# EAGLE design AT1846S (EAGLE 7.2.0)
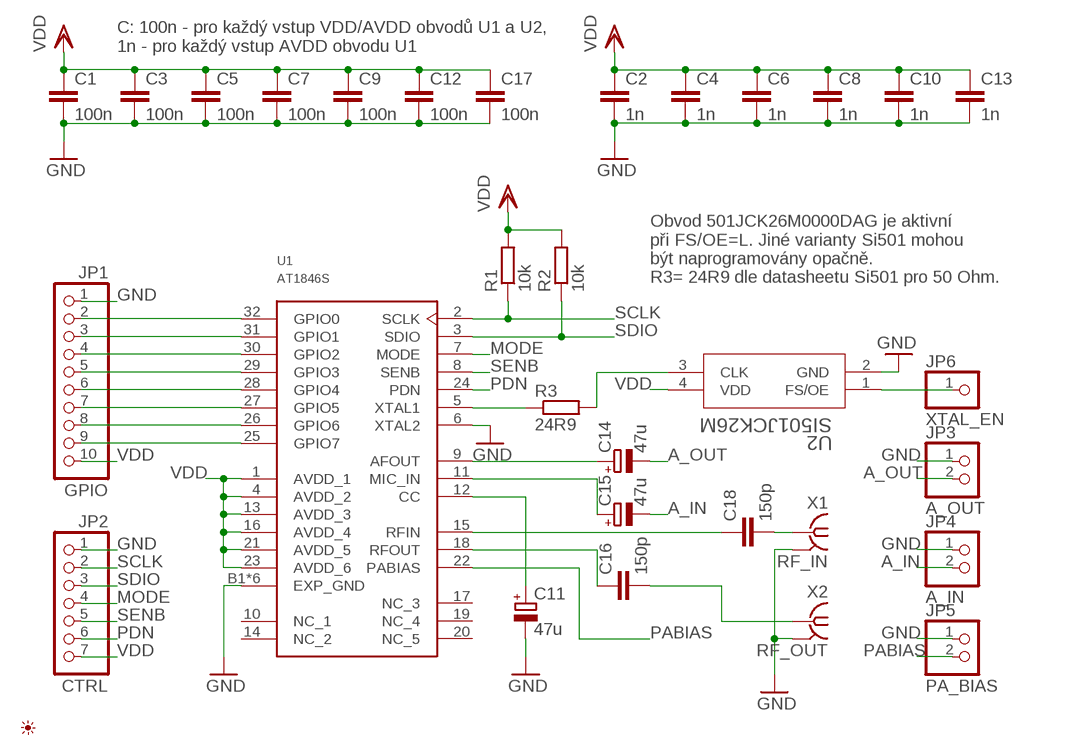
[diagram p0: schematic, sheet 1]

## Parts
C1  100n  C-EUC0603  [C0603]
C2  1n  C-EUC0603  [C0603]
C3  100n  C-EUC0603  [C0603]
C4  1n  C-EUC0603  [C0603]
C5  100n  C-EUC0603  [C0603]
C6  1n  C-EUC0603  [C0603]
C7  100n  C-EUC0603  [C0603]
C8  1n  C-EUC0603  [C0603]
C9  100n  C-EUC0603  [C0603]
C10  1n  C-EUC0603  [C0603]
C11  47u  CPOL-EUSMCA  [SMC_A]
C12  100n  C-EUC0603  [C0603]
C13  1n  C-EUC0603  [C0603]
C14  47u  CPOL-EUSMCA  [SMC_A]
C15  47u  CPOL-EUSMCA  [SMC_A]
C16  150p  C-EUC0603  [C0603]
C17  100n  C-EUC0603  [C0603]
C18  150p  C-EUC0603  [C0603]
JP1  GPIO  PINHD-1X10  [1X10]
JP2  CTRL  PINHD-1X7  [1X07]
JP3  A_OUT  PINHD-1X2  [1X02]
JP4  A_IN  PINHD-1X2  [1X02]
JP5  PA_BIAS  PINHD-1X2  [1X02]
JP6  XTAL_EN  PINHD-1X1  [1X01]
PICTO1  PICTO_1  [PICTO_1]
R1  10k  R-EU_R0603  [R0603]
R2  10k  R-EU_R0603  [R0603]
R3  24R9  R-EU_R0603  [R0603]
U1  AT1846S  [QFN32]
U2  SI501JCK26M  501  [SI501_4_2X2.5]
X1  RF_IN  SMA-142-0701-801/806  [J502-ND-142-0701-801/806]
X2  RF_OUT  SMA-142-0701-801/806  [J502-ND-142-0701-801/806]

## Nets
A_IN: C15.- JP4.2
A_OUT: C14.- JP3.2
GND: C1.2 C2.2 C3.2 C4.2 C5.2 C6.2 C7.2 C8.2 C9.2 C10.2 C11.- C12.2 C13.2 C17.2 JP1.1 JP2.1 JP3.1 JP4.1 JP5.1 U1.6(XTAL2) U1.B1(EXP_GND) U1.B2(EXP_GND) U1.B3(EXP_GND) U1.B4(EXP_GND) U1.B5(EXP_GND) U1.EXP(EXP_GND) U2.2(GND) X1.G@1 X1.G@2 X1.G@3 X1.G@4 X2.G@1 X2.G@2 X2.G@3 X2.G@4
MODE: JP2.4 U1.7(MODE)
N$1: C11.+ U1.12(CC)
N$2: C14.+ U1.9(AFOUT)
N$3: C15.+ U1.11(MIC_IN)
N$4 [RF]: C16.1 U1.18(RFOUT)
N$5 [RF]: C18.1 U1.15(RFIN)
N$6: R3.2 U2.3(CLK)
N$7: JP6.1 U2.1(FS/OE)
N$8: JP1.2 U1.32(GPIO0)
N$9: JP1.3 U1.31(GPIO1)
N$10: JP1.4 U1.30(GPIO2)
N$11: JP1.5 U1.29(GPIO3)
N$12: JP1.6 U1.28(GPIO4)
N$13: JP1.7 U1.27(GPIO5)
N$14: JP1.8 U1.26(GPIO6)
N$15: JP1.9 U1.25(GPIO7)
N$16 [RF]: C16.2 X2.1
N$17: R3.1 U1.5(XTAL1)
N$18 [RF]: C18.2 X1.1
PABIAS: JP5.2 U1.22(PABIAS)
PDN: JP2.6 U1.24(PDN)
SCLK: JP2.2 R1.1 U1.2(SCLK)
SDIO: JP2.3 R2.1 U1.3(SDIO)
SENB: JP2.5 U1.8(SENB)
VDD: C1.1 C2.1 C3.1 C4.1 C5.1 C6.1 C7.1 C8.1 C9.1 C10.1 C12.1 C13.1 C17.1 JP1.10 JP2.7 R1.2 R2.2 U1.1(AVDD_1) U1.4(AVDD_2) U1.13(AVDD_3) U1.16(AVDD_4) U1.21(AVDD_5) U1.23(AVDD_6) U2.4(VDD)
Unconnected: U1.10(NC_1) U1.14(NC_2) U1.17(NC_3) U1.19(NC_4) U1.20(NC_5)

## Notes on the sheet
- C: 100n - pro každý vstup VDD/AVDD obvodů U1 a U2,
  1n - pro každý vstup AVDD obvodu U1
- Obvod 501JCK26M0000DAG je aktivní
  při FS/OE=L. Jiné varianty Si501 mohou
  být naprogramovány opačně.
  R3= 24R9 dle datasheetu Si501 pro 50 Ohm.

## Library data of the parts
C1-C10 C12 C13 C16-C18 = rcl:C-EU: CAPACITOR, European symbol
C11 C14 C15 = rcl:CPOL-EU: POLARIZED CAPACITOR, European symbol
JP1 = pinhead:PINHD-1X10: PIN HEADER
JP2 = pinhead:PINHD-1X7: PIN HEADER
JP3-JP5 = pinhead:PINHD-1X2: PIN HEADER
JP6 = pinhead:PINHD-1X1: PIN HEADER
PICTO1 = My_Picto:PICTO_1: Zdenek Brichacek; OK3ZB; http://blog.brichacek.net
R1-R3 = rcl:R-EU_: RESISTOR, European symbol
U1 = Auctus:AT1846S: The RDA1846 is a highly integrated single-chip transceiver for Walkie Talkie applications.
U2 = Silicon Labs:501; MANUFACTURER_PART_NUMBER: 501; VENDOR: SILICONLABS
X1 X2 = con-coax:SMA-: SMA 50 Ohm End Launch Jack Receptacle - Round Contact Johnson Components Source: www.johnsoncomponents.com .. J502-ND.pdf; MF: JOHNSON COMPONENTS; MPN: 142-0701-801; OC_FARNELL: 1608592; OC_NEWARK: 90F2624

## Net classes
1 RF: clearance 0.381 mm

## Board
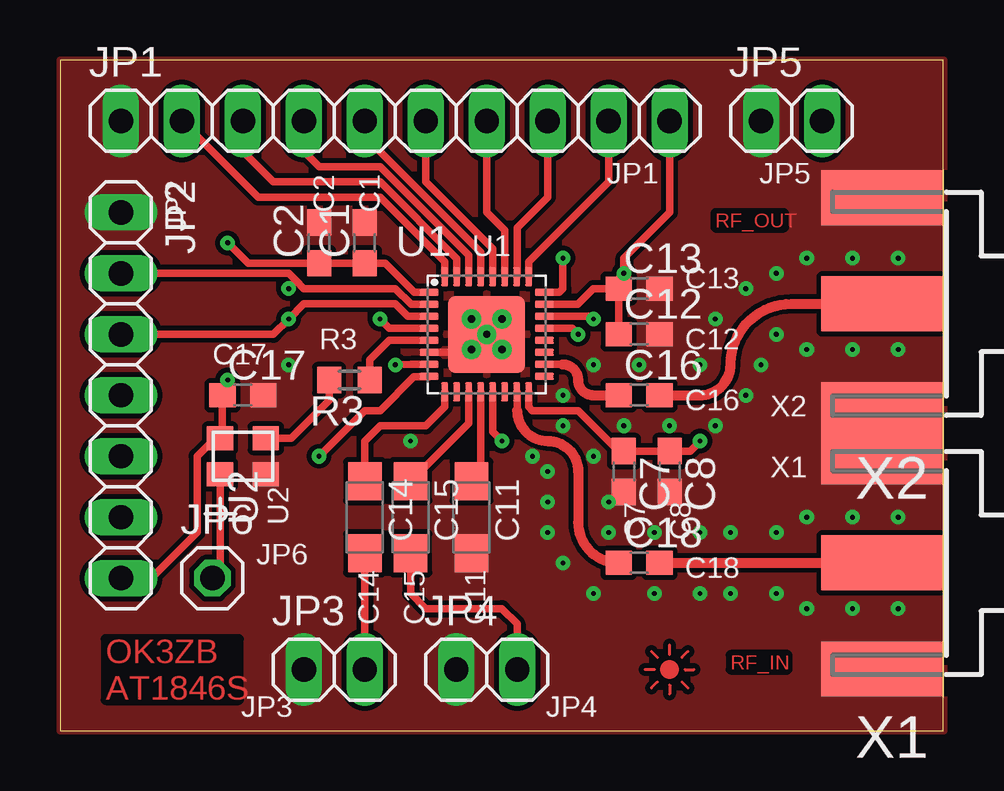
[diagram p1: board, top side]
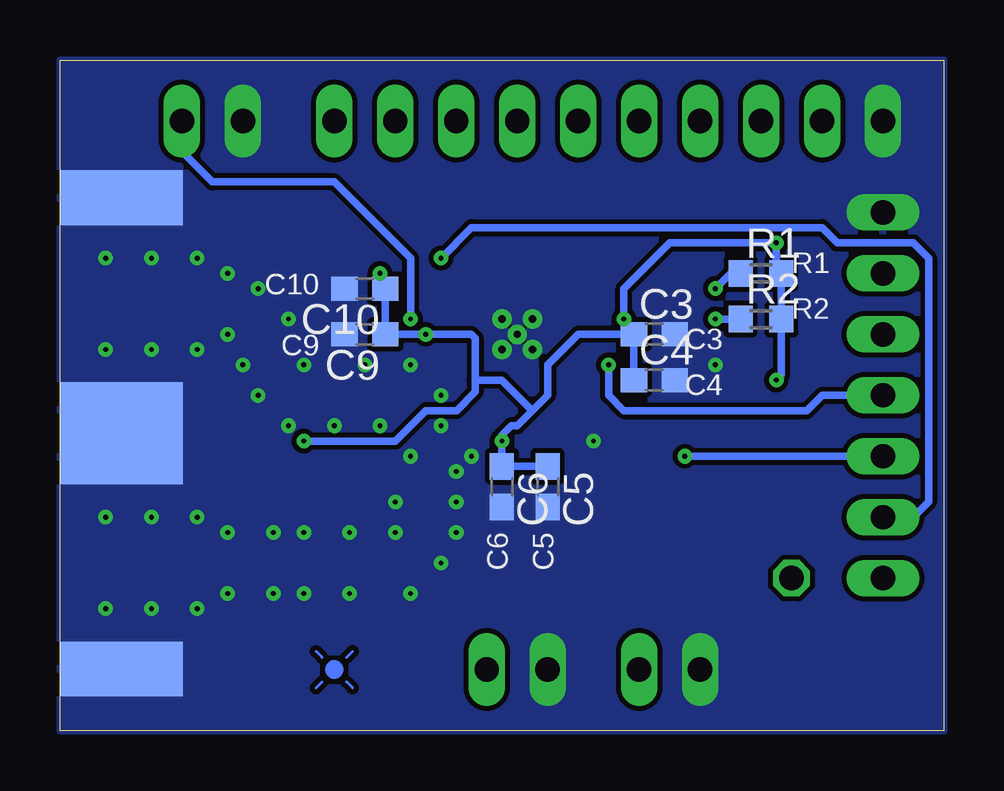
[diagram p2: board, bottom side, seen from below]

Size 36.83 x 27.94 mm. Coordinates in mm from the lower left corner, seen from the top.
Outline: 0,0 36.81,0 36.81,27.94 0,27.94 0,0
Copper layers (1*16): Top 0.035mm / dielectric 1.5mm / Bottom 0.035mm
Design rules "default *": minimum track width 10mil, minimum drill 24mil, track to track 8mil, track to pad 8mil, pad to pad 8mil, via to via 8mil, smd to smd 8mil, copper to edge 0mil, drill to drill 8mil, minimum pad ring 10mil, minimum via ring 8mil, stop-mask expansion 4mil, vias tented up to drill 0mil, thermal gap 0mil

### Footprints (pad centres in the part's own frame; a part is rotated, then mirrored left to right if it is on the bottom)
C0603 = smd 1.1 x 1: 1 -0.85,0; 2 0.85,0
SMC_A = smd 1.6 x 1.4: + -1.5,0; - 1.5,0
1X10 = drill 1.016 long: 1 -11.43,0; 2 -8.89,0; 3 -6.35,0; 4 -3.81,0; 5 -1.27,0; 6 1.27,0; 7 3.81,0; 8 6.35,0; 9 8.89,0; 10 11.43,0
1X07 = drill 1.016 long: 1 -7.62,0; 2 -5.08,0; 3 -2.54,0; 4 0,0; 5 2.54,0; 6 5.08,0; 7 7.62,0
1X02 = drill 1.016 long: 1 -1.27,0; 2 1.27,0
1X01 = drill 1.016 octagon: 1 0,0
R0603 = smd 1 x 1.1: 1 -0.85,0; 2 0.85,0
QFN32 = smd 0.8 x 0.3: 1 -2.4,1.75; 2 -2.4,1.25; 3 -2.4,0.75; 4 -2.4,0.25; 5 -2.4,-0.25; 6 -2.4,-0.75; 7 -2.4,-1.25; 8 -2.4,-1.75; 17 2.4,-1.75; 18 2.4,-1.25; 19 2.4,-0.75; 20 2.4,-0.25; 21 2.4,0.25; 22 2.4,0.75; 23 2.4,1.25; 24 2.4,1.75 | smd 0.3 x 0.8: 9 -1.75,-2.4; 10 -1.25,-2.4; 11 -0.75,-2.4; 12 -0.25,-2.4; 13 0.25,-2.4; 14 0.75,-2.4; 15 1.25,-2.4; 16 1.75,-2.4; 25 1.75,2.4; 26 1.25,2.4; 27 0.75,2.4; 28 0.25,2.4; 29 -0.25,2.4; 30 -0.75,2.4; 31 -1.25,2.4; 32 -1.75,2.4 | drill 0.3: B1 -0.635,0.635; B2 0.635,0.635; B3 -0.635,-0.635; B4 0.635,-0.635; B5 0,0 | smd 3.2 x 3.2: EXP 0,0
SI501_4_2X2.5 = smd 0.991 x 1.092: 1 -0.75,0.95; 2 -0.75,-0.95; 3 0.75,-0.95; 4 0.75,0.95
J502-ND-142-0701-801/806 = smd 5.08 x 2.286: 1 2.565,0; G@1 2.565,4.42; G@2 2.565,-4.42 | smd 5.08 x 2.286 bottom: G@3 2.565,4.42; G@4 2.565,-4.42

### Placement (x,y rotation side)
C1  12.7,20.32 90 top
C2  10.79,20.32 90 top
C3  12.06,16.51 0 bottom
C4  12.06,14.61 0 bottom
C5  16.51,10.16 270 bottom
C6  18.41,10.16 270 bottom
C7  23.5,10.79 270 top
C8  25.4,10.79 270 top
C9  24.13,16.51 180 bottom
C10  24.13,18.41 180 bottom
C11  17.14,8.89 270 top
C12  24.13,16.51 0 top
C13  24.13,18.41 0 top
C14  12.7,8.89 270 top
C15  14.61,8.89 270 top
C16  24.13,13.97 0 top
C17  7.62,13.97 0 top
C18  24.13,6.99 0 top
JP1  13.97,25.4 0 top
JP2  2.54,13.97 270 top
JP3  11.43,2.54 0 top
JP4  17.78,2.54 0 top
JP5  30.48,25.4 0 top
JP6  6.35,6.35 0 top
PICTO1  25.4,2.54 0 top
R1  7.62,19.05 0 bottom
R2  7.62,17.14 0 bottom
R3  12.06,14.61 180 top
U1  17.78,16.51 0 top
U2  7.62,11.43 90 top
X1  36.83,6.99 180 top
X2  36.83,17.78 180 top

### Tracks (layer width: path | path; a pad name or v marks a point on that pad's centre or on a via)
A_IN
  Top 0.305: C15.- 14.61,5.71 15.24,5.08 18.41,5.08 19.05,4.45 JP4.2
A_OUT
  Top 0.305: C14.- JP3.2
GND  (via drill 0.2)
  Top 0.305: U1.6 17.03,15.76 U1.B3 U1.EXP | U1.EXP U1.B4 | U1.B2 U1.EXP | U1.B1 U1.EXP
  other vias: 20.95,13.97 19.68,11.43 20.95,12.7 20.32,10.79 20.32,9.53 20.32,8.26 20.95,6.99 22.23,5.71 24.77,5.71 26.67,5.71 27.94,5.71 29.84,5.71 31.11,5.08 33.02,5.08 34.92,5.08 34.92,8.89 33.02,8.89 31.11,8.89 29.84,8.26 27.94,8.26 26.67,8.26 24.77,8.26 22.86,8.26 22.23,11.43 22.86,9.53 22.23,15.24 24.13,15.24 26.67,15.24 27.3,17.14 28.57,18.41 29.84,19.05 31.11,19.68 34.92,19.68 33.02,19.68 34.92,15.88 33.02,15.88 31.11,15.88 29.84,16.51 29.21,15.24 28.57,13.97 27.3,12.7 25.4,12.7 23.5,12.7 9.53,15.24 14.61,12.06
  pour Bottom: 0,27.94 36.83,27.94 36.83,0 0,0
  pour Top: 0,27.94 36.83,27.94 36.83,0 0,0
MODE  (via drill 0.2)
  Top 0.305: U1.7 14.62,15.26 v13.97,15.24
  Bottom 0.305: JP2.4 5.08,13.97 5.71,13.34 13.34,13.34 13.97,13.97 v13.97,15.24
N$1
  Top 0.305: U1.12 17.53,10.78 C11.+
N$2
  Top 0.305: U1.9 16.03,13.49 15.24,12.7 13.34,12.7 12.7,12.06 C14.+
N$3
  Top 0.305: U1.11 17.03,12.81 C15.+
N$4
  Top 0.305: U1.18 20.93,15.26
  Top 0.406: 20.93,15.26 arc-90 21.59,14.61 arc90 22.23,13.97 C16.1
N$5
  Top 0.305: U1.15 19.05,14.09 19.05,13.34
  Top 0.406: 19.05,13.34 arc90 20.32,12.06 arc-90 21.59,10.79 21.59,8.68 arc90 C18.1
N$6
  Top 0.305: R3.2 11.21,13.76 9.64,12.18 U2.3
N$7
  Top 0.305: U2.1 6.67,6.67 JP6.1
N$8
  Top 0.305: U1.32 16.03,19.53 13.34,22.23 8.26,22.23 JP1.2
N$9
  Top 0.305: U1.31 16.53,19.66 13.34,22.86 8.89,22.86 7.62,24.13 JP1.3
N$10
  Top 0.305: U1.30 17.03,19.8 13.34,23.5 10.79,23.5 10.16,24.13 JP1.4
N$11
  Top 0.305: U1.29 17.53,19.93 12.7,24.77 JP1.5
N$12
  Top 0.305: U1.28 18.03,20.07 15.24,22.86 JP1.6
N$13
  Top 0.305: U1.27 18.53,20.84 17.78,21.59 JP1.7
N$14
  Top 0.305: U1.26 19.05,18.93 19.05,20.95 20.32,22.23 JP1.8
N$15
  Top 0.305: U1.25 19.53,19.53 22.86,22.86 JP1.9
N$16
  Top 0.406: C16.2 26.67,13.97 arc90 27.94,15.24 arc-90 30.48,17.78 X2.1
N$17
  Top 0.305: U1.5 13.72,16.26 12.91,15.46 R3.1
N$18
  Top 0.406: C18.2 X1.1
PABIAS  (via drill 0.2)
  Top 0.305: U1.22 22.11,17.26 v22.23,17.14
  Bottom 0.305: v22.23,17.14 22.23,19.68 25.4,22.86 30.48,22.86 31.75,24.13 JP5.2
PDN  (via drill 0.2)
  Top 0.305: U1.24 20.8,18.26 20.95,18.41 v20.95,19.68
  Bottom 0.305: v20.95,19.68 19.68,20.95 5.08,20.95 4.45,20.32 1.27,20.32 0.64,19.68 0.64,9.53 1.27,8.89 JP2.6
SCLK  (via drill 0.2)
  Top 0.305: U1.2 14.62,17.76 13.97,18.41 10.16,18.41 9.84,18.73 | 9.84,18.73 9.53,19.05 JP2.2 | v9.53,18.41 9.84,18.73
  Bottom 0.305: R1.1 8.89,19.05 v9.53,18.41
SDIO  (via drill 0.2)
  Top 0.305: U1.3 14.49,17.26 13.97,17.78 10.16,17.78 v9.53,17.14 8.89,16.51 JP2.3
  Bottom 0.305: R2.1 v9.53,17.14
SENB  (via drill 0.2)
  Top 0.305: U1.8 15.38,14.74 14.74,14.74 13.34,13.34 12.7,13.34 v10.79,11.43
  Bottom 0.305: v10.79,11.43 JP2.5
VDD  (via drill 0.2)
  Top 0.305: U1.23 21.57,17.76 22.23,18.41 C13.1 | U1.4 13.72,16.76 v13.34,17.14 | U1.1 14.76,18.26 13.55,19.47 C1.1 C2.1 7.83,19.47 v6.99,20.32 | C13.1 C9.1 | C13.1 23.28,18.84 v23.5,19.05 23.5,19.68 25.4,21.59 JP1.10 | U1.16 19.53,13.49 19.68,13.34 21.59,13.34 23.28,11.64 C7.1 C8.1 26.25,11.64 v26.67,12.06 | U1.13 18.03,12.45 v18.41,12.06 | v6.99,14.61 6.99,14.19 C17.1 6.77,12.28 U2.4 6.46,12.18 5.71,11.43 5.71,8.26 3.81,6.35 JP2.7 | U1.21 21.34,16.76 v21.59,16.51
  Bottom 0.305: C3.1 13.34,16.93 v13.34,17.14 13.34,18.41 11.43,20.32 v6.99,20.32 6.99,19.27 R1.2 R2.2 6.77,14.82 v6.99,14.61 | C3.1 C4.1 | v23.5,19.05 23.5,18.63 C13.1 C9.1 v21.59,16.51 19.68,16.51 19.53,16.36 19.53,14.61 | C5.1 C6.1 v18.41,12.06 18.41,12.31 18.03,12.7 17.78,12.7 17.14,13.34 | C3.1 15.24,16.51 16.51,15.24 16.51,13.97 17.14,13.34 | 19.53,14.61 U1.16 20.3,13.34 21.59,13.34 22.86,12.06 v26.67,12.06 | 19.53,14.61 18.41,14.61 17.14,13.34

### Text on the board
Top: RF_OUT | RF_IN | OK3ZB / AT1846S
_tNames: JP2 | JP1 | JP5 | C2 | C1 | U1 | C13 | R3 | C12 | C17 | X2 | C16 | X1 | C7 | C8 | U2 | JP6 | C14 | C15 | C11 | C18 | JP3 | JP4
_bNames: R1 | C10 | R2 | C9 | C3 | C4 | C5 | C6